# EAGLE design ECG_V2 (EAGLE 7.6.0)
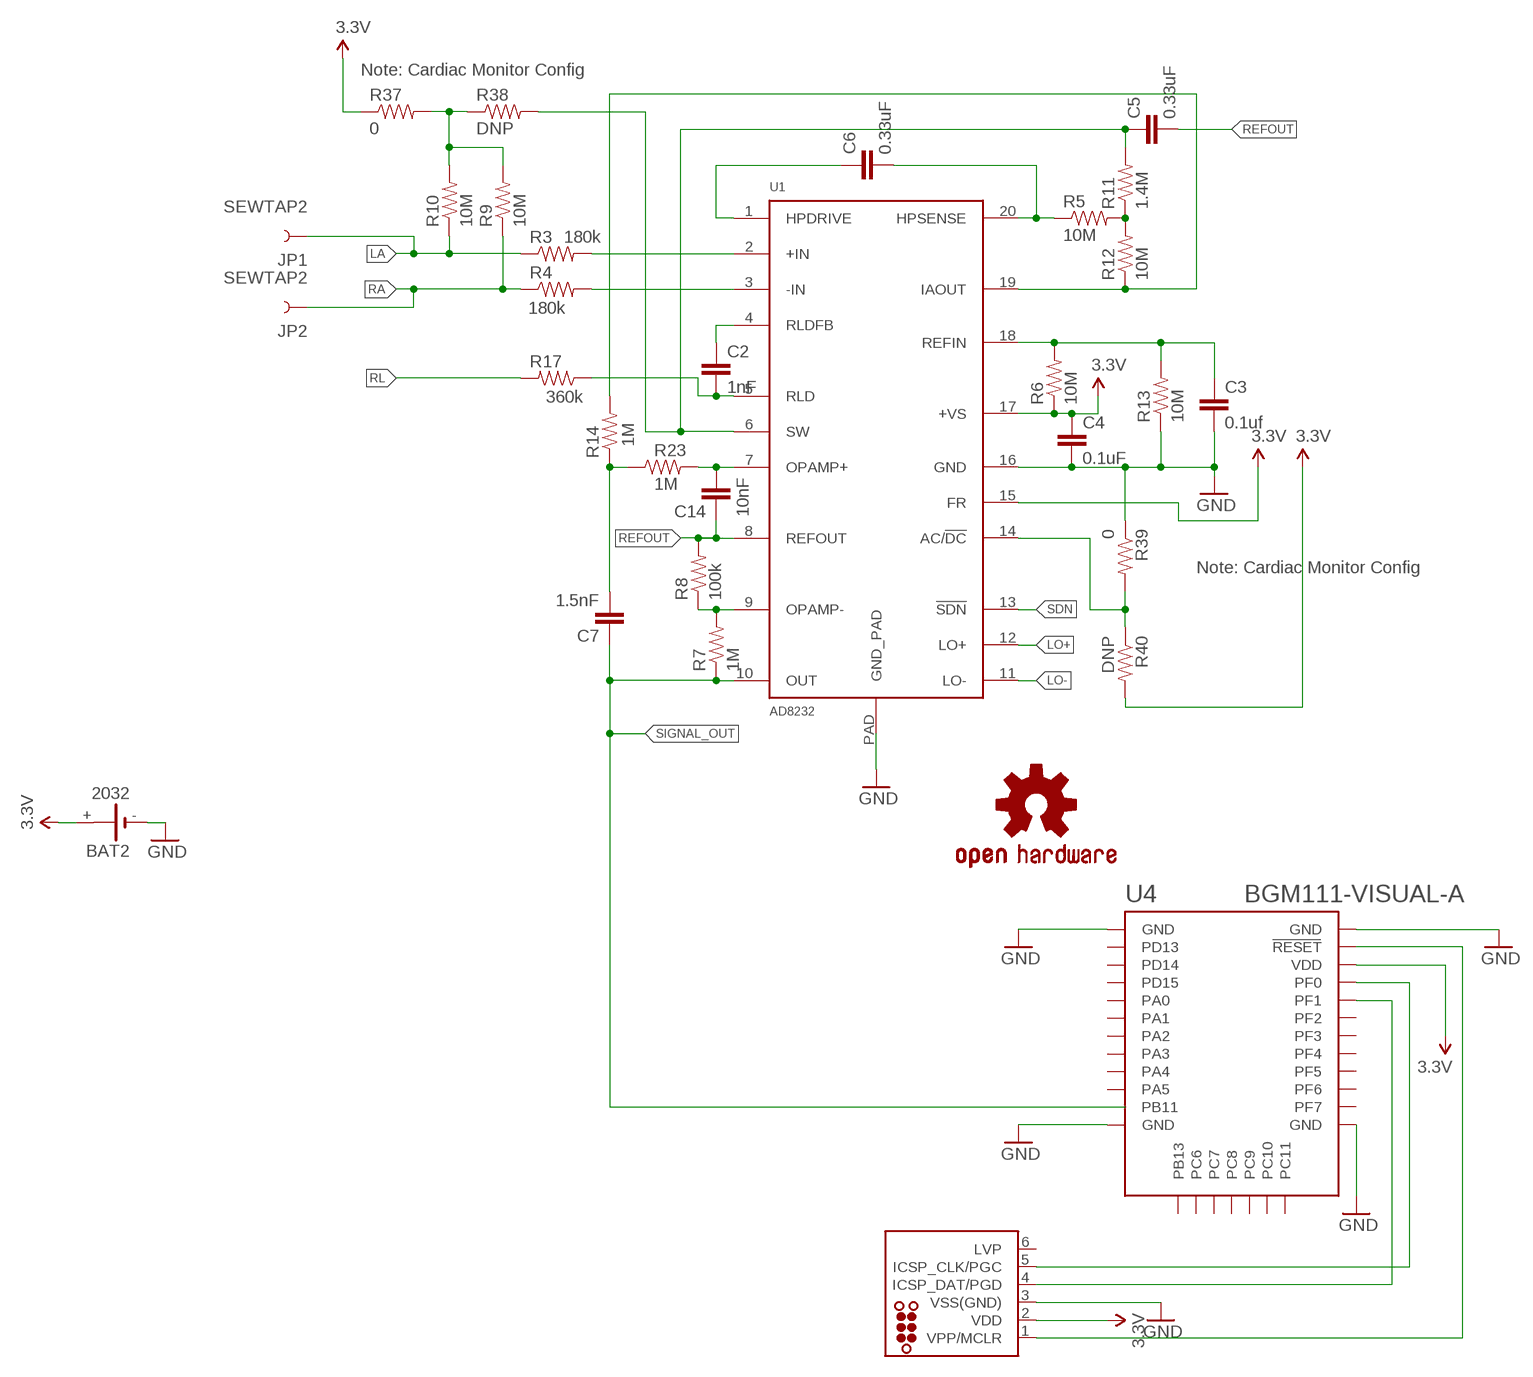
[diagram p0: schematic, sheet 1]

## Parts
BAT2  2032  [KZH20SMD]
C2  1nF  CAP0603-CAP  [0603-CAP]
C3  0.1uf  CAP0603-CAP  [0603-CAP]
C4  0.1uF  CAP0603-CAP  [0603-CAP]
C5  0.33uF  CAP0805  [0805]
C6  0.33uF  CAP0805  [0805]
C7  1.5nF  CAP0603-CAP  [0603-CAP]
C14  10nF  CAP0603-CAP  [0603-CAP]
J1  TC2030-MCP-NL  [TC2030-MCP-NL]
JP1  SEWTAP2  [PETAL-LONG-2]
JP2  SEWTAP2  [PETAL-LONG-2]
LOGO3  OSHW-LOGOS  [OSHW-LOGO-S]
R3  180k  RESISTOR0603-RES  [0603-RES]
R4  180k  RESISTOR0603-RES  [0603-RES]
R5  10M  RESISTOR0603-RES  [0603-RES]
R6  10M  RESISTOR0603-RES  [0603-RES]
R7  1M  RESISTOR0603-RES  [0603-RES]
R8  100k  RESISTOR0603-RES  [0603-RES]
R9  10M  RESISTOR0603-RES  [0603-RES]
R10  10M  RESISTOR0603-RES  [0603-RES]
R11  1.4M  RESISTOR0603-RES  [0603-RES]
R12  10M  RESISTOR0603-RES  [0603-RES]
R13  10M  RESISTOR0603-RES  [0603-RES]
R14  1M  RESISTOR0603-RES  [0603-RES]
R17  360k  RESISTOR0603-RES  [0603-RES]
R23  1M  RESISTOR0603-RES  [0603-RES]
R37  0  0OHM1/10W5%(0603)  [0603]
R38  DNP  0OHM1/10W5%(0603)  [0603]
R39  0  0OHM1/10W5%(0603)  [0603]
R40  DNP  0OHM1/10W5%(0603)  [0603]
U1  AD8232  [LFCSP_20]
U4  BGM111-VISUAL-A  [BGM111-A]

## Nets
3.3V: BAT2.+ C4.1 J1.2(VDD) R6.1 R37.1 R40.2 U1.15(FR) U1.17(+VS) U4.VDD
GND: BAT2.- C3.2 C4.2 J1.3(VSS(GND)) R13.1 R39.1 U1.16(GND) U1.PAD(GND_PAD) U4.GND U4.GND@2(GND) U4.GND@3(GND) U4.GND@4(GND)
LA: JP1.1 R3.1 R10.1
LO+: U1.12(LO+)
LO-: U1.11(LO-)
N$1: R3.2 U1.2(+IN)
N$2: J1.5(ICSP_CLK/PGC) U4.PF0
N$3: C14.2 R23.2 U1.7(OPAMP+)
N$4: C6.2 R5.1 U1.20(HPSENSE)
N$5: C3.1 R6.2 R13.2 U1.18(REFIN)
N$6: J1.4(ICSP_DAT/PGD) U4.PF1
N$9: R7.2 R8.1 U1.9(OPAMP-)
N$13: C6.1 U1.1(HPDRIVE)
N$14: R5.2 R11.1 R12.2
N$15: R4.2 U1.3(-IN)
N$16: C5.1 R11.2 R38.2 U1.6(SW)
N$18: C7.2 R14.1 R23.1
N$27: C2.1 U1.4(RLDFB)
N$30: C2.2 R17.1 U1.5(RLD)
N$32: R12.1 R14.2 U1.19(IAOUT)
N$34: R9.2 R10.2 R37.2 R38.1
N$35: R39.2 R40.1 U1.14(AC/!DC)
N$38: J1.1(VPP/MCLR) U4.RESET
RA: JP2.1 R4.1 R9.1
REFOUT: C5.2 C14.1 R8.2 U1.8(REFOUT)
RL: R17.2
SDN: U1.13(!SDN)
SIGNAL_OUT: C7.1 R7.1 U1.10(OUT)
Unconnected: J1.6(LVP) U4.PA0 U4.PA1 U4.PA2 U4.PA3 U4.PA4 U4.PA5 U4.PB11 U4.PB13 U4.PC6 U4.PC7 U4.PC8 U4.PC9 U4.PC10 U4.PC11 U4.PD13 U4.PD14 U4.PD15 U4.PF2 U4.PF3 U4.PF4 U4.PF5 U4.PF6 U4.PF7

## Notes on the sheet
- Note: Cardiac Monitor Config
- Note: Cardiac Monitor Config

## Library data of the parts
BAT2 = SMTU-2032-1:2032
C2-C7 C14 = SparkFun-Passives:CAP: Capacitor Standard 0603 ceramic capacitor, and 0.1" leaded capacitor.
J1 = tag-connect:TC2030: TAG-CONNECT ICSP Connector Manufacturer: Tag-Connect <http://www.tag-connect.com> Cable for easy In-Circuit Serial Programming. Designed for Microchip ICD2, suitable for many others. Two variants - one "with legs" (for hands-free fit on PCB) and another "without legs" for quick programming. PAD Description 1 MCLR/Vpp 2 Vdd 3 GND 4 PGD (ISPDAT) 5 PGC (ISPCLK) 6 nc (used for LVP) ©2009 ROFA.cz - modified and updated by Robert Darlington ‹rdarlington@gmail.com›
JP1 JP2 = LilyPad-Wearables:SEWTAP: Sew Taps for LilyPad Boards.
LOGO3 = SparkFun-Aesthetics:OSHW-LOGO: Open Source Hardware Logo This logo indicates the piece of hardware it is found on incorporates a OSHW license and/or adheres to the definition of open source hardware found here: http://freedomdefined.org/OSHW
R3-R14 R17 R23 = SparkFun-Passives:RESISTOR: Resistor Basic schematic elements and footprints for 0603, 1206, and PTH resistors.
R37 R39 = SparkFun-Resistors:0OHM1/10W5%(0603): RES-08609; PROD_ID: RES-08609
R38 R40 = SparkFun-Resistors:0OHM1/10W5%(0603): RES-08609; PROD_ID: RES-08609; VALUE: 0
U1 = AD8232:AD8232
U4 = sf-bluegiga:BGM111-VISUAL: Bluetooth 4.1 (4.2 ready) low-energy module (Bluetooth Smart) - BGM111-A variant has an on-module ceramic chip antenna. BGM111-A variant includes keepout/restrict area. Antenna edge of the module should be flush up against the edge of the PCB. See datasheet for variant layout details. IT IS EXTREMELY IMPORTANT THAT YOU FOLLOW THE LAYOUT GUIDELINES FOR THIS MODULE IN ORDER TO ENSURE MAXIMUM RANGE. THIS MEANS THAT YOU NEED A SOLID GROUND PLANE EXTENDING IDEALLY 17 mm ON THE LEFT AND RIGHT SIDES OF THE MODULE, AS SHOWN IN THE DATASHEET. The Silicon Labs Blue Gecko BGM111 Bluetooth® Smart module integrates our next generation wireless SoC with a complete Bluetooth Smart software stack and antenna to provide a complete, pre-certified plug-and-play Bluetooth Smart solution. It solves one of the major customer roadblocks for fast time-to-market as it integrates antenna, software and RF certifications, saving months of engineering effort and testing. https://www.silabs.com/products/wireless/bluetooth/Pages/BGM111-bluetooth-smart-module.aspx https://github.com/jrowberg/sf-oshw Last updated 2015-09-02 by Jeff Rowberg <jeff@rowberg.net>; ANTENNA: On-module ceramic chip antenna

## Board
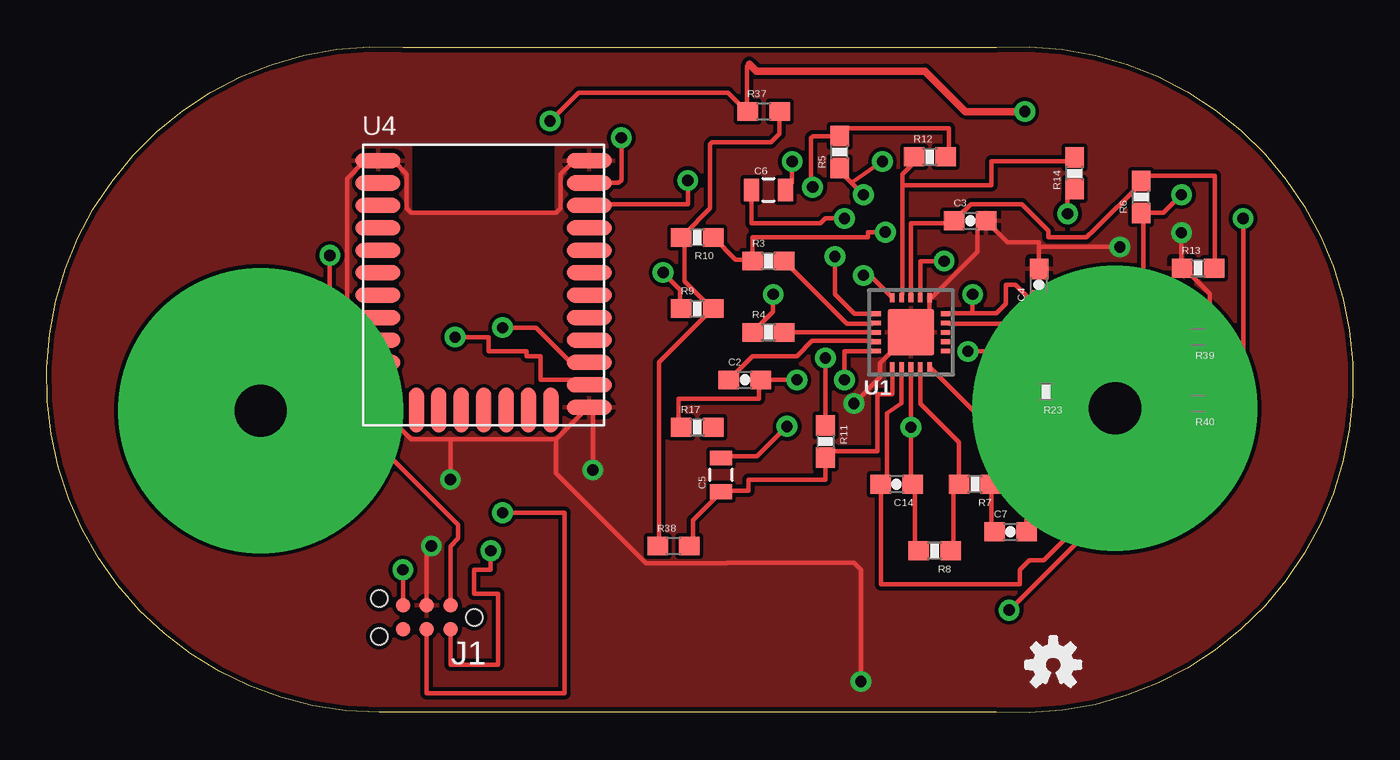
[diagram p1: board, top side]
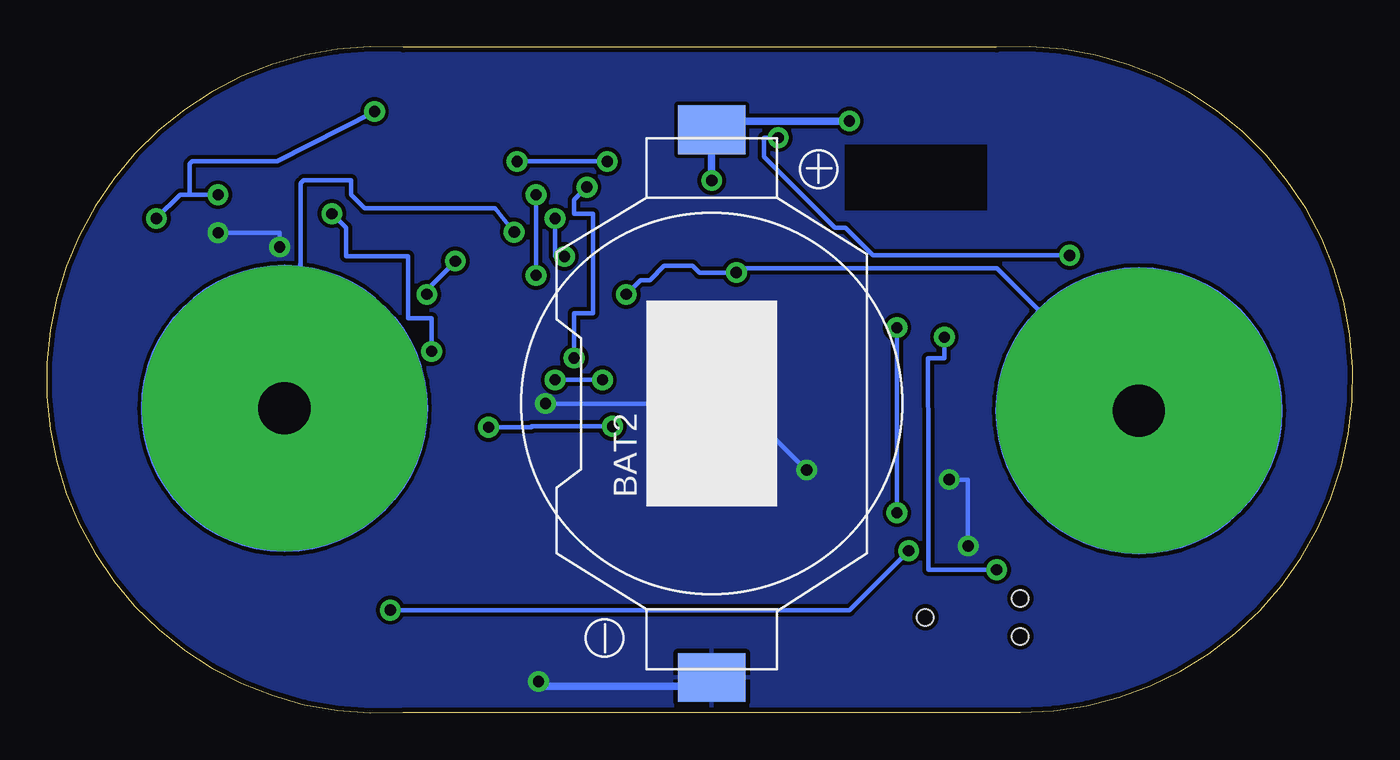
[diagram p2: board, bottom side, seen from below]

Size 69.88 x 35.64 mm. Coordinates in mm from the lower left corner, seen from the top.
Outline: 50.81,0.04 17.79,0.04 arc-184 19.06,35.6 50.81,35.6 arc-188 50.81,0.04
Copper layers (1*16): Top 0.035mm / dielectric 1.5mm / Bottom 0.035mm
Design rules "SparkFun": minimum track width 8mil, minimum drill 20mil, track to track 8mil, track to pad 8mil, pad to pad 8mil, via to via 8mil, smd to smd 8mil, copper to edge 10mil, drill to drill 8mil, minimum pad ring 12mil, minimum via ring 10mil, stop-mask expansion 4mil, vias tented up to drill 25mil, thermal gap 10mil

### Footprints (pad centres in the part's own frame; a part is rotated, then mirrored left to right if it is on the bottom)
KZH20SMD = smd 2.6 x 3.6: + 14.65,0; - -14.65,0
0603-CAP = smd 1.1 x 1: 1 -0.85,0; 2 0.85,0
0805 = smd 0.8 x 1.2: 1 -0.9,0; 2 0.9,0
TC2030-MCP-NL = smd 0.787 x 0.787: 1 1.27,-0.635; 2 1.27,0.635; 3 2.54,-0.635; 4 2.54,0.635; 5 3.81,-0.635; 6 3.81,0.635 | hole 0.889: 0,0; 5.08,-1.016; 5.08,1.016
PETAL-LONG-2 = drill 2.794 pad 15.24: 1 0,0
0603-RES = smd 1.1 x 1: 1 -0.85,0; 2 0.85,0
0603 = smd 1.1 x 1: 1 -0.85,0; 2 0.85,0
LFCSP_20 = smd 0.5 x 0.25: 1 -1.85,1; 2 -1.85,0.5; 3 -1.85,0; 4 -1.85,-0.5; 5 -1.85,-1; 11 1.85,-1; 12 1.85,-0.5; 13 1.85,0; 14 1.85,0.5; 15 1.85,1 | smd 0.25 x 0.5: 6 -1,-1.85; 7 -0.5,-1.85; 8 0,-1.85; 9 0.5,-1.85; 10 1,-1.85; 16 1,1.85; 17 0.5,1.85; 18 0,1.85; 19 -0.5,1.85; 20 -1,1.85 | smd 2.5 x 2.5: PAD 0,0
BGM111-A = smd 2.4 x 0.8: GND -5.65,6.65; GND@2 -5.65,-6.55; GND@3 5.65,-6.55; GND@4 5.65,6.65; PA0 -5.65,1.85; PA1 -5.65,0.65; PA2 -5.65,-0.55; PA3 -5.65,-1.75; PA4 -5.65,-2.95; PA5 -5.65,-4.15; PB11 -5.65,-5.35; PD13 -5.65,5.45; PD14 -5.65,4.25; PD15 -5.65,3.05; PF0 5.65,-5.35; PF1 5.65,-4.15; PF2 5.65,-2.95; PF3 5.65,-1.75; PF4 5.65,-0.55; PF5 5.65,0.65; PF6 5.65,1.85; PF7 5.65,3.05; RESET 5.65,5.45; VDD 5.65,4.25 | smd 0.8 x 2.4: PB13 -3.6,-6.7; PC6 -2.4,-6.7; PC7 -1.2,-6.7; PC8 0,-6.7; PC9 1.2,-6.7; PC10 2.4,-6.7; PC11 3.6,-6.7

### Placement (x,y rotation side)
BAT2  34.3,16.55 90 bottom
C2  37.35,17.82 0 top
C3  49.41,26.33 0 top
C4  53.1,22.9 90 top
C5  36.08,12.74 90 top
C6  38.62,27.98 0 top
C7  51.57,9.69 0 top
C14  45.48,12.23 180 top
J1  22.87,5.12 180 top
JP1  57.16,16.29 0 bottom
JP2  11.44,16.17 0 bottom
LOGO3  53.86,2.58 0 top
R3  38.62,24.17 0 top
R4  38.62,20.36 0 top
R5  42.43,30.01 90 top
R6  58.56,27.6 90 top
R7  49.67,12.23 180 top
R8  47.51,8.67 180 top
R9  34.81,21.63 0 top
R10  34.81,25.44 180 top
R11  41.67,14.52 270 top
R12  47.26,29.76 0 top
R13  61.61,23.79 0 top
R14  55,28.87 90 top
R17  34.81,15.28 0 top
R23  53.48,17.18 180 top
R37  38.37,32.17 0 top
R38  33.54,8.93 0 top
R39  61.61,20.1 180 top
R40  61.61,16.55 180 top
U1  46.24,20.36 0 top
U4  23.38,22.9 0 top

### Tracks (layer width: path | path; a pad name or v marks a point on that pad's centre or on a via)
3.3V  (via drill 0.6, 0.61)
  Top 0.254: 60.64,15.02 60.64,14.64 v51.5,5.5 | 60.64,15.02 60.64,16.47 R40.2 | U1.15 48.11,21.37 49.54,21.37 | 49.54,21.37 50.81,21.37 51.32,21.88 51.32,22.9 51.83,22.9 52.68,22.05 C4.1 53.1,22.19 53.15,22.14 58.69,22.14 58.69,26.75 R6.1 59.74,26.75 v60.72,27.72 | U1.17 46.75,24.17 v48.02,24.17 | v49.54,22.39 49.54,21.37 | 60.64,15.02 64.02,15.02 v64.02,26.45 | U4.VDD 29.1,27.22 34.3,27.22 v34.3,28.49 | v26.94,31.66 28.46,33.19 36.46,33.19 37.48,32.17 R37.1 37.48,32.21 37.48,34.58 37.6,34.71 | J1.2 21.6,2.58 24.14,2.58 24.14,6.39 22.87,6.39 22.87,7.66 23.76,7.66 v23.76,8.67
  Top 0.406: 37.6,34.71 37.98,34.33 47,34.33 49.16,32.17 v52.34,32.17
  Bottom 0.254: v51.5,5.5 26.94,5.5 v23.76,8.67 | v48.02,24.17 49.54,22.64 v49.54,22.39 | 62.24,27.72 62.75,27.72 v64.02,26.45 | 62.24,27.72 v60.72,27.72 | BAT2.+ 33.84,31.66 | v52.34,32.17 57.54,29.5 62.11,29.5 62.24,29.38 62.24,27.72
  Bottom 0.406: v26.94,31.66 33.84,31.66 | BAT2.+ v34.3,28.49
GND  (via drill 0.6)
  Top 0.254: 27.27,14.64 21.6,14.64 | 21.6,14.64 19.49,14.64 17.89,16.24 U4.GND@2 17.66,16.47 16.75,16.47 16.06,17.16 16.06,28.59 16.98,29.5 17.66,29.5 U4.GND 17.89,29.5 18.58,29.5 19.26,28.82 19.26,26.99 19.49,26.76 27.27,26.76 27.49,26.99 27.49,28.82 28.18,29.5 28.87,29.5 U4.GND@4 | 27.27,14.64 28.87,16.24 U4.GND@3 29.22,16.16 v29.22,12.99 | R39.1 62.24,20.13 62.24,22.42 60.87,23.79 R13.1 60.72,23.79 v60.72,25.69 | 27.27,14.64 27.27,12.81 32.07,8.01 36.41,8.01 36.44,8.04 43.19,8.04 43.57,7.66 v43.57,1.69 | v21.6,12.48 21.6,14.64 | v57.42,24.93 53.1,24.93 C4.2 53.1,25.18 51.41,25.18 C3.2 49.8,25.86 49.8,24.68 47.33,22.21 U1.16 47.24,21.36 U1.PAD 44.59,18.71 44.59,17.95 v43.19,16.55 | v20.59,8.93 20.33,8.93 J1.3
  Bottom 0.254: v20.59,8.93 20.59,12.48 v21.6,12.48 | v29.22,12.99 32.78,16.55 v43.19,16.55 | v57.42,24.93 57.42,25.69 v60.72,25.69 | v43.57,1.69 43.32,1.44 | 35.32,1.44 34.85,1.9 BAT2.-
  Bottom 0.406: 35.32,1.44 43.57,1.44 v43.57,1.69
  pour Top: 0.01,36.87 69.86,36.87 69.86,30.52 69.86,-1.23 0.01,-1.23
  pour Bottom: 0.01,36.87 69.86,36.87 69.86,-1.23 0.01,-1.23
LA  (via drill 0.61)
  Top 0.254: R10.1 35.72,25.39 36.87,24.24 37.55,24.24 R3.1 37.77,25.44 43.95,25.44 43.95,25.72 v44.87,25.72
  Bottom 0.254: 56.3,16.7 56.3,24.17 | JP1.1 56.3,24.17 | 56.3,24.17 56.3,28.33 56.15,28.49 53.61,28.49 53.61,27.72 52.87,26.99 45.88,26.99 v44.87,25.72
N$1
  Top 0.254: U1.2 44.18,20.82 42.81,20.82 39.61,24.02 R3.2
N$2  (via drill 0.6)
  Top 0.254: U4.PF0 29.03,17.82 26.43,17.82 26.43,19.09 25.67,19.09 25.67,19.34 23.63,19.34 23.63,20.1 v21.86,20.1 | v19.06,7.66 J1.5
  Bottom 0.254: v21.86,20.1 21.86,18.96 22.74,18.96 22.74,18.45 22.69,14.19 22.69,7.66 v19.06,7.66
N$3
  Top 0.254: R23.2 52.84,17.18 52.84,14.77 54.88,14.77 54.88,9.69 53.35,8.17 52.59,8.17 52.08,7.66 52.08,6.9 44.64,6.9 44.64,12.13 C14.2 44.97,12.57 44.97,16.04 45.74,16.56 U1.7
N$4  (via drill 0.6)
  Top 0.254: C6.2 39.89,28.35 v39.89,29.5 | U1.20 44.04,23.41 v43.7,23.41 | v43.7,27.72 43.06,28.36 | 43.06,28.36 42.43,28.99 R5.1 | v44.72,29.5 43.06,28.36
  Bottom 0.254: v43.7,23.41 v43.7,27.72 | v39.89,29.5 v44.72,29.5
N$5
  Top 0.254: U1.18 46.24,26.2 48.44,26.2 C3.1 48.75,26.53 49.44,27.22 52.18,27.22 53.61,25.79 53.61,25.44 55.64,25.44 56.04,25.84 56.07,25.84 58.56,28.33 R6.2 58.56,28.74 62.5,28.74 62.5,23.79 R13.2
N$6  (via drill 0.6)
  Top 0.254: v24.4,10.71 27.7,10.71 27.7,1.05 20.33,1.05 J1.4 | v24.4,20.61 26.17,20.61 27.95,18.83 28.46,18.83 28.55,18.75 U4.PF1
  Bottom 0.254: v24.4,10.71 v24.4,20.61
N$9
  Top 0.254: 48.3,8.7 R8.1 48.53,8.7 48.53,11.9 48.75,12.13 R7.2 48.82,14.48 46.75,16.55 U1.9
N$13  (via drill 0.6)
  Top 0.254: C6.1 37.72,26.2 41.41,26.2 41.67,26.45 v42.68,26.45 | v42.18,24.42 42.18,22.39 43.21,21.36 U1.1
  Bottom 0.254: v42.68,26.45 42.68,24.42 v42.18,24.42
N$14  (via drill 0.61)
  Top 0.254: v40.98,28.13 40.98,28.59 40.91,28.66 40.91,30.77 40.99,30.86 R5.2 42.85,31.28 48.27,31.28 48.27,29.76 R12.2 | v41.67,18.99 R11.1
  Bottom 0.254: v40.98,28.13 41.67,27.45 41.67,26.71 40.65,26.71 40.65,21.37 41.67,21.37 v41.67,18.99
N$15
  Top 0.254: R4.2 U1.3
N$16
  Top 0.254: R38.2 34.58,8.93 34.58,10.3 35.95,11.67 C5.1 36.18,11.9 37.55,11.9 37.55,12.48 41.67,12.48 R11.2 42.01,14.01 44.46,14.01 44.46,17.06 45.22,17.06 45.24,17.07 U1.6
N$18  (via drill 0.6)
  Top 0.254: 54.37,18.58 54.37,17.18 R23.1 54.33,18.58 | 54.33,18.58 54.33,19.34 v49.29,19.34 | C7.2 52.42,14.01 51.57,14.01 51.57,18.58 54.33,18.58 | R14.1 54.62,27.64 v54.62,26.71
  Bottom 0.254: v49.29,19.34 49.29,21.12 50.56,21.12 50.56,24.42 53.86,24.42 53.86,25.95 v54.62,26.71
N$27
  Top 0.254: U1.4 44.18,19.9 40.96,19.9 40.14,19.09 37.77,19.09 C2.1
N$30  (via drill 0.6)
  Top 0.254: R17.1 33.79,15.44 33.79,16.8 38.11,16.8 38.11,17.82 C2.2 v40.14,17.82 | v42.68,17.82 42.68,19.36 U1.5
  Bottom 0.254: v40.14,17.82 v42.68,17.82
N$32
  Top 0.254: 45.78,28.23 45.78,28.82 46.41,29.44 R12.1 | 45.78,28.23 45.78,22.42 U1.19 | R14.2 54.93,29.5 50.56,29.5 50.56,28.23 45.78,28.23
N$34
  Top 0.254: R38.1 32.75,8.93 32.75,18.76 35.5,21.5 R9.2 35.5,21.73 34.12,23.1 34.12,25.39 R10.2 34.12,25.62 35.5,26.99 35.5,30.42 35.6,30.52 38.75,30.52 39.22,30.99 R37.2
N$35
  Top 0.254: U1.14 48.3,20.82 51.95,20.82 52.64,20.13 60.64,20.13 R39.2 60.87,19.9 62.24,18.53 62.24,16.7 R40.1
N$38  (via drill 0.6, 0.61)
  Top 0.254: v15.15,24.47 15.15,16.93 22.01,10.07 22.01,9.33 21.6,8.93 J1.1 | U4.RESET 30.61,28.35 30.75,28.49 v30.75,30.77
  Bottom 0.254: v15.15,24.47 25.67,24.47 27.14,25.95 27.7,25.95 31.51,29.76 31.51,30.77 v30.75,30.77
RA  (via drill 0.6, 0.61)
  Top 0.254: v32.98,23.56 33.9,22.64 33.9,21.73 R9.1 | R4.1 38.87,21.46 v38.87,22.39
  Bottom 0.254: 11.95,16.7 16.95,21.7 | 16.95,21.7 19.04,23.79 32.98,23.79 v32.98,23.56 | JP2.1 16.95,21.7 | 33.08,23.66 v32.98,23.56 | v38.87,22.39 38.11,23.15 37.6,23.15 36.84,23.91 35.32,23.91 34.96,23.56 v32.98,23.56
REFOUT  (via drill 0.6, 0.61)
  Top 0.254: R8.2 46.47,8.7 46.47,12.13 C14.1 46.24,12.32 v46.24,15.28 U1.8 | v39.61,15.33 38.01,13.73 36.18,13.73 C5.2
  Bottom 0.254: v39.61,15.33 43.95,15.33 43.95,15.28 v46.24,15.28
SIGNAL_OUT
  Top 0.254: U1.10 50.52,15.23 R7.1 50.58,12.13 50.56,12.1 50.56,9.69 C7.1